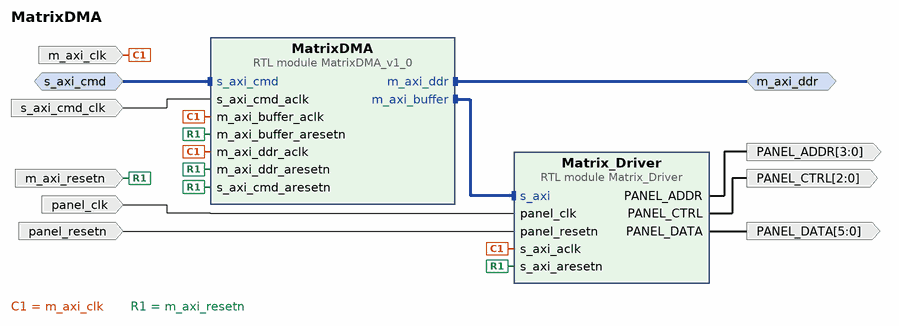
[diagram p0: block diagram of the top level]
# Vivado block design MatrixDMA, xc7z020clg400-1, Vivado 2021.2.1
create_bd_design MatrixDMA

create_bd_intf_port -mode Master -vlnv xilinx.com:interface:aximm_rtl:1.0 m_axi_ddr
set_property -dict [list \
  CONFIG.ADDR_WIDTH 32 \
  CONFIG.DATA_WIDTH 32 \
  CONFIG.HAS_REGION 0 \
  CONFIG.NUM_READ_OUTSTANDING 2 \
  CONFIG.NUM_WRITE_OUTSTANDING 2 \
  CONFIG.PROTOCOL AXI4 \
] [get_bd_intf_ports m_axi_ddr]
create_bd_intf_port -mode Slave -vlnv xilinx.com:interface:aximm_rtl:1.0 s_axi_cmd
set_property -dict [list \
  CONFIG.ADDR_WIDTH 16 \
  CONFIG.ARUSER_WIDTH 0 \
  CONFIG.AWUSER_WIDTH 0 \
  CONFIG.BUSER_WIDTH 0 \
  CONFIG.DATA_WIDTH 32 \
  CONFIG.HAS_BRESP 1 \
  CONFIG.HAS_BURST 0 \
  CONFIG.HAS_CACHE 0 \
  CONFIG.HAS_LOCK 0 \
  CONFIG.HAS_PROT 1 \
  CONFIG.HAS_QOS 0 \
  CONFIG.HAS_REGION 0 \
  CONFIG.HAS_RRESP 1 \
  CONFIG.HAS_WSTRB 1 \
  CONFIG.ID_WIDTH 0 \
  CONFIG.MAX_BURST_LENGTH 1 \
  CONFIG.NUM_READ_OUTSTANDING 1 \
  CONFIG.NUM_READ_THREADS 1 \
  CONFIG.NUM_WRITE_OUTSTANDING 1 \
  CONFIG.NUM_WRITE_THREADS 1 \
  CONFIG.PROTOCOL AXI4LITE \
  CONFIG.READ_WRITE_MODE READ_WRITE \
  CONFIG.RUSER_BITS_PER_BYTE 0 \
  CONFIG.RUSER_WIDTH 0 \
  CONFIG.SUPPORTS_NARROW_BURST 0 \
  CONFIG.WUSER_BITS_PER_BYTE 0 \
  CONFIG.WUSER_WIDTH 0 \
] [get_bd_intf_ports s_axi_cmd]
create_bd_port -dir O -from 5 -to 0 PANEL_DATA
create_bd_port -dir O -from 3 -to 0 PANEL_ADDR
create_bd_port -dir O -from 2 -to 0 PANEL_CTRL
create_bd_port -dir I -type clk panel_clk
create_bd_port -dir I -type rst panel_resetn
create_bd_port -dir I -type clk s_axi_cmd_clk
set_property -dict {CONFIG.FREQ_HZ 100000000} [get_bd_ports s_axi_cmd_clk]
create_bd_port -dir I -type clk m_axi_clk
set_property -dict {CONFIG.FREQ_HZ 100000000} [get_bd_ports m_axi_clk]
create_bd_port -dir I m_axi_resetn

create_bd_cell -type module -reference MatrixDMA_v1_0 MatrixDMA
set_property -dict [list \
  CONFIG.C_M_AXI_BUFFER_ARUSER_WIDTH 1 \
  CONFIG.C_M_AXI_BUFFER_AWUSER_WIDTH 1 \
  CONFIG.C_M_AXI_BUFFER_BUSER_WIDTH 1 \
  CONFIG.C_M_AXI_BUFFER_RUSER_WIDTH 1 \
  CONFIG.C_M_AXI_BUFFER_WUSER_WIDTH 1 \
  CONFIG.C_M_AXI_DDR_ARUSER_WIDTH 1 \
  CONFIG.C_M_AXI_DDR_AWUSER_WIDTH 1 \
  CONFIG.C_M_AXI_DDR_RUSER_WIDTH 1 \
  CONFIG.C_M_AXI_DDR_WUSER_WIDTH 1 \
] [get_bd_cells MatrixDMA]
create_bd_cell -type module -reference Matrix_Driver Matrix_Driver

# ---- connections ----

connect_bd_intf_net [get_bd_intf_pins Matrix_Driver/s_axi] [get_bd_intf_pins MatrixDMA/m_axi_buffer]
connect_bd_intf_net -intf_net MatrixDMA_v1_0_0_m_axi_ddr [get_bd_intf_ports m_axi_ddr] [get_bd_intf_pins MatrixDMA/m_axi_ddr]
connect_bd_intf_net -intf_net s_axi_cmd_0_1 [get_bd_intf_ports s_axi_cmd] [get_bd_intf_pins MatrixDMA/s_axi_cmd]
connect_bd_net [get_bd_pins Matrix_Driver/PANEL_ADDR] [get_bd_ports PANEL_ADDR]
connect_bd_net [get_bd_pins Matrix_Driver/PANEL_CTRL] [get_bd_ports PANEL_CTRL]
connect_bd_net [get_bd_pins Matrix_Driver/PANEL_DATA] [get_bd_ports PANEL_DATA]
connect_bd_net -net m_axi_buffer_aclk_0_1 [get_bd_ports m_axi_clk] \
  [get_bd_pins MatrixDMA/m_axi_buffer_aclk] [get_bd_pins MatrixDMA/m_axi_ddr_aclk] [get_bd_pins Matrix_Driver/s_axi_aclk]
connect_bd_net -net m_axi_cmd_clk_1 [get_bd_ports s_axi_cmd_clk] [get_bd_pins MatrixDMA/s_axi_cmd_aclk]
connect_bd_net [get_bd_ports m_axi_resetn] \
  [get_bd_pins MatrixDMA/s_axi_cmd_aresetn] [get_bd_pins MatrixDMA/m_axi_buffer_aresetn] \
  [get_bd_pins MatrixDMA/m_axi_ddr_aresetn] [get_bd_pins Matrix_Driver/s_axi_aresetn]
connect_bd_net -net panel_clk_0_1 [get_bd_ports panel_clk] [get_bd_pins Matrix_Driver/panel_clk]
connect_bd_net -net panel_resetn_0_1 [get_bd_ports panel_resetn] [get_bd_pins Matrix_Driver/panel_resetn]

# ---- address map ----
assign_bd_address -offset 0x00000000 -range 4G -target_address_space [get_bd_addr_spaces MatrixDMA/m_axi_buffer] [get_bd_addr_segs Matrix_Driver/s_axi/reg0]
assign_bd_address -offset 0x44A00000 -range 64K -target_address_space [get_bd_addr_spaces MatrixDMA/m_axi_ddr] [get_bd_addr_segs m_axi_ddr/Reg]
assign_bd_address -offset 0x0000 -range 4K -target_address_space [get_bd_addr_spaces s_axi_cmd] [get_bd_addr_segs MatrixDMA/s_axi_cmd/reg0]

validate_bd_design
save_bd_design
